# Altium schematic sheet Indicator.SchDoc
size A; SheetNumber: 2; SheetTotal: 2
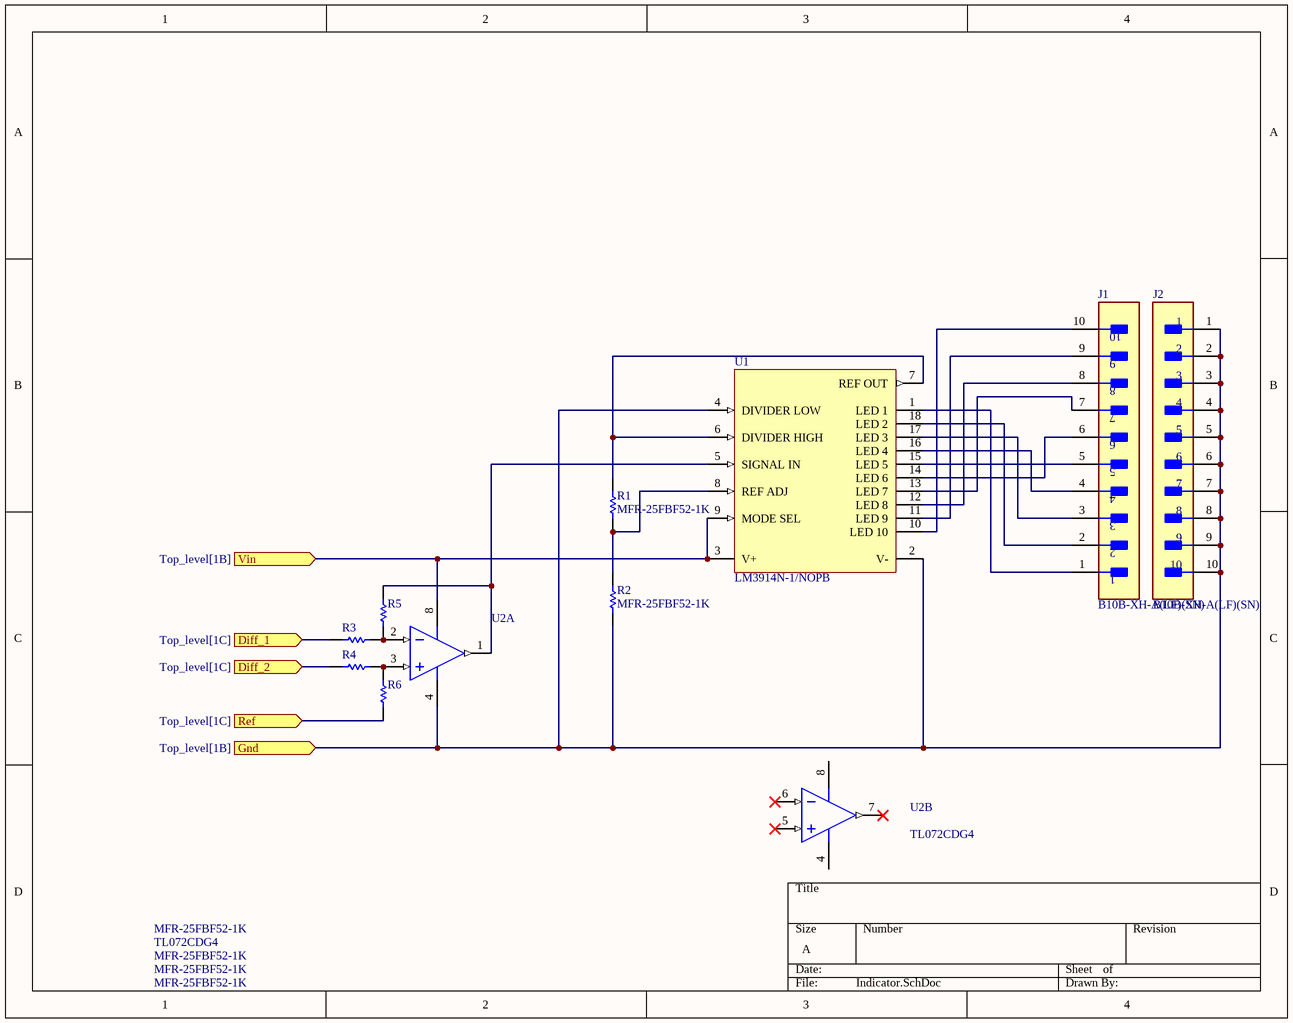
[diagram p0: Indicator.SchDoc]

## Parts
J1  B10B-XH-A(LF)(SN)  [FP-B10B-XH-A_LF_SN-MFG]
J2  B10B-XH-A(LF)(SN)  [FP-B10B-XH-A_LF_SN-MFG]
R1  MFR-25FBF52-1K  [RESA60-630X240]
R2  MFR-25FBF52-1K  [RESA60-630X240]
R3  MFR-25FBF52-1K  [RESA60-630X240]
R4  MFR-25FBF52-1K  [RESA60-630X240]
R5  MFR-25FBF52-1K  [RESA60-630X240]
R6  MFR-25FBF52-1K  [RESA60-630X240]
U1  LM3914N-1/NOPB  [NFK0018A]
U2  TL072CDG4  [TI-D8_M]  (parts A,B of 2)

## Ports
Diff_1 (in, see Top_level[1C]), Diff_2 (in, see Top_level[1C]), Gnd (in, see Top_level[1B]), Ref (in, see Top_level[1C]), Vin (in, see Top_level[1B])

## Nets
Diff_1: R3.2 ; port Diff_1
Diff_2: R4.2 ; port Diff_2
Gnd: J2.1 J2.2 J2.3 J2.4 J2.5 J2.6 J2.7 J2.8 J2.9 J2.10 R2.1 U1.2(V-) U1.4(DIVIDER_LOW) U2.4(VCC-) ; port Gnd
Ref: R6.1 ; port Ref
Vin: U1.3(V+) U1.9(MODE_SEL) U2.8(VCC+) ; port Vin
NetJ1_1: J1.1 U1.1(LED_1)
NetJ1_2: J1.2 U1.18(LED_2)
NetJ1_3: J1.3 U1.17(LED_3)
NetJ1_4: J1.4 U1.16(LED_4)
NetJ1_5: J1.5 U1.15(LED_5)
NetJ1_6: J1.6 U1.14(LED_6)
NetJ1_7: J1.7 U1.13(LED_7)
NetJ1_8: J1.8 U1.12(LED_8)
NetJ1_9: J1.9 U1.11(LED_9)
NetJ1_10: J1.10 U1.10(LED_10)
NetR1_1: R1.1 R2.2 U1.8(REF_ADJ)
NetR1_2: R1.2 U1.6(DIVIDER_HIGH) U1.7(REF_OUT)
NetR3_1: R3.1 R5.1 U2.2(IN1-)
NetR4_1: R4.1 R6.2 U2.3(IN1+)
NetR5_2: R5.2 U1.5(SIGNAL_IN) U2.1(OUT1)

Not connected (* = marked no-connect by the designer): U2 5(IN2+)* 6(IN2-)* 7(OUT2)*

## Library data of the parts
J1 J2 = CMP-17439-000145-1: CONN HEADER VERT 10POS 2.5MM; Voltage Rating: 250V; Current Rating: 3A; Wire/Cable Gauge: 22AWG; Number of Contacts: 10; Contact Resistance: 20mR; Mated Stacking Heights: 9.8mm; Gender: Male; Insulation Resistance: 1GR; Series: XH; Max Current Rating: 3A; Contact Shape: Square; Contact Material: Brass; Housing Material: Polyamide; Lead Free: Lead Free; Orientation: Straight; Max Voltage Rating (DC): 250V; Contact Type: Male Pin; Number of Positions: 10; Length: 27.4mm; Housing Color: White; Max Voltage Rating (AC): 250V; Depth: 5.75mm; Mount: Through Hole; Pitch: 2.5mm; Fastening Type: Detent; Flammability Rating: UL94 V-0; Color: Natural; Contact Plating: Tin; Insulation Color: Natural; Packaging: Bulk; REACH SVHC: No SVHC; Insulation Material: Nylon; Connector Type: Header; Lead Pitch: 2.5mm; Contact Finish - Mating: TIN; Voltage Rating (AC): 250V; Number of Rows: 1; Max Operating Temperature: 85°C; Min Operating Temperature: -25°C; Termination: Solder
R1-R6 = CMP-1659-00075-1: Axial Resistor, 1 KOhm, +/- 1%, 250 mW, -55 to 155 degC, 2-Pin THD, RoHS, Bulk; Voltage Rating: 250 V; Resistance: 10 kohm; Power Rating: 250 mW; ComponentLink2Description: Datasheet; RoHSCompliant: true; PackageReference: MFR-25; Case\Package: Axial; Max Operating Temperature: 155 degC; DatasheetVersion: Apr-13; Tolerance: 1%; ComponentLink1URL: http://www.yageo.com/; Length: 0.248 inch; ComponentLink2URL: http://www.yageo.com/documents/recent/Yageo%20LR_MFR_2013.pdf; Packaging: Bulk; Package Quantity: 200; PackageDescription: 2-Pin Axial Lead, Dia 2.4 mm, Body Length 6.3 mm; Min Operating Temperature: -55 degC; ComponentLink1Description: Manufacturer URL
U1 = CMP-0058-00003-3: Dot/Bar Display Driver, 18-pin MDIP, Pb-Free; Manufacturer: Texas Instruments; PackageTopMarking: NSUZXYYTTE#*LM3914N-1; PowerWise: N; CompType: Audio IC; ComponentLink1URL: http://www.ti.com/general/docs/lit/getliterature.tsp?genericPartNumber=LM3914&fileType=pdf; RoHS: Y; ComponentLink1Description: Datasheet URL; Code_JEDEC: MS-001-AC; PinCount: 18; PackageReference: NFK0018A; PackageDescription: MDIP, .900 x .250 x .155in, 18 Lead, .100in Pitch
U2 = CMP-0017-00466-1: Dual Low-Noise JFET-Input General-Purpose Operational Amplifier, 7 to 36 V, 0 to 70 degC, 8-pin SOIC (D8), Green (RoHS & no Sb/Br); Manufacturer: Texas Instruments; Iq per channel(Max)(mA): 2.5; Vn at 1kHz(Typ)(nV/rtHz): 18; GBW(Typ)(MHz): 3; Total Supply Voltage(Max)(+5V is 5, +/-5V is 10): 36; IIB(Max)(pA): 200; Number of Channels: 2; CMRR(Min)(dB): 70; Rating: Catalog; Total Supply Voltage(Min)(+5V is 5, +/-5V is 10): 7; Slew Rate(Typ)(V/us): 13; Vio (25C)(Max)(mV): 10; Sub Family: General Purpose Amplifier, High Supply Voltage Amplifier (>=30V); ComponentLink3URL: http://www.ti.com/litv/pdf/msoi002j; ComponentLink1Description: Manufacturer URL; PackageReference: D8; PackageDescription: 8-Pin Plastic Small Outline, Body 4.9 x 3.9 mm, Pitch 1.27 mm; PartNumber: TL072CDG4; Mounting Technology: Surface Mount; Code_JEDEC: MS-012; ComponentLink2Description: Datasheet; PackageVersion: 4040047-3/M, 06/2011; Eco-Plan: Green (RoHS & no Sb/Br); ComponentLink1URL: http://www.ti.com/; ComponentLink3Description: Package Specification; Offset Drift(Typ)(uV/C): 18; ComponentLink2URL: http://www.ti.com/lit/ds/symlink/tl072.pdf; DatasheetVersion: SLOS080J